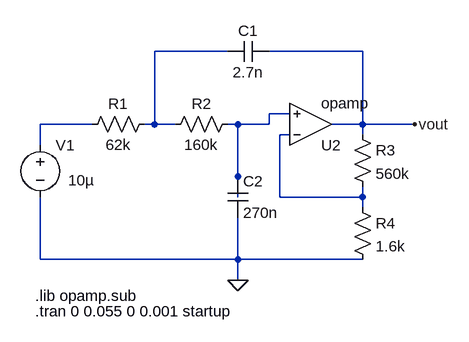
[diagram p0: schematic circuito_datos1.asc]
circuito_datos1.asc, the LTspice schematic file:
Version 4
SHEET 1 880 680
WIRE 288 -16 176 -16
WIRE 496 -16 352 -16
WIRE 384 80 352 80
WIRE 80 96 0 96
WIRE 176 96 176 -16
WIRE 176 96 160 96
WIRE 208 96 176 96
WIRE 304 96 288 96
WIRE 352 96 352 80
WIRE 352 96 304 96
WIRE 496 96 496 -16
WIRE 496 96 448 96
WIRE 576 96 496 96
WIRE 384 112 368 112
WIRE 496 112 496 96
WIRE 0 128 0 96
WIRE 304 176 304 96
WIRE 304 208 304 176
WIRE 368 208 368 112
WIRE 496 208 496 192
WIRE 496 208 368 208
WIRE 496 224 496 208
WIRE 0 304 0 208
WIRE 304 304 304 240
WIRE 304 304 0 304
WIRE 496 304 304 304
WIRE 304 336 304 304
FLAG 304 336 0
FLAG 576 96 vout
SYMBOL voltage 0 112 R0
WINDOW 123 0 0 Left 0
WINDOW 39 0 0 Left 0
WINDOW 3 43 70 Left 2
SYMATTR Value 10µ
SYMATTR InstName V1
SYMBOL res 64 112 R270
WINDOW 0 32 56 VTop 2
WINDOW 3 0 56 VBottom 2
SYMATTR InstName R1
SYMATTR Value 62k
SYMBOL res 192 112 R270
WINDOW 0 32 56 VTop 2
WINDOW 3 0 56 VBottom 2
SYMATTR InstName R2
SYMATTR Value 160k
SYMBOL cap 288 176 R0
SYMATTR InstName C2
SYMATTR Value 270n
SYMBOL cap 352 -32 R90
WINDOW 0 0 32 VBottom 2
WINDOW 3 32 32 VTop 2
SYMATTR InstName C1
SYMATTR Value 2.7n
SYMBOL res 480 96 R0
SYMATTR InstName R3
SYMATTR Value 560k
SYMBOL res 480 208 R0
SYMATTR InstName R4
SYMATTR Value 1.6k
SYMBOL OpAmps\\opamp 416 160 M180
SYMATTR InstName U2
TEXT -8 360 Left 2 !.lib opamp.sub
TEXT -8 384 Left 2 !.tran 0 0.055 0 0.001 startup

The netlist it stands for:
* circuito_datos1.asc
V1 N003 0 10µ
R1 N003 N001 62k
R2 N001 N002 160k
C2 N002 0 270n
C1 vout N001 2.7n
R3 vout N004 560k
R4 N004 0 1.6k
XU2 N004 N002 vout opamp Aol=100K GBW=10Meg  ; pins invin noninvin out
.lib opamp.sub
.tran 0 0.055 0 0.001 startup
.backanno
.end